# EAGLE schematic pyPhotometry_2.0 (EAGLE 6.6.0)
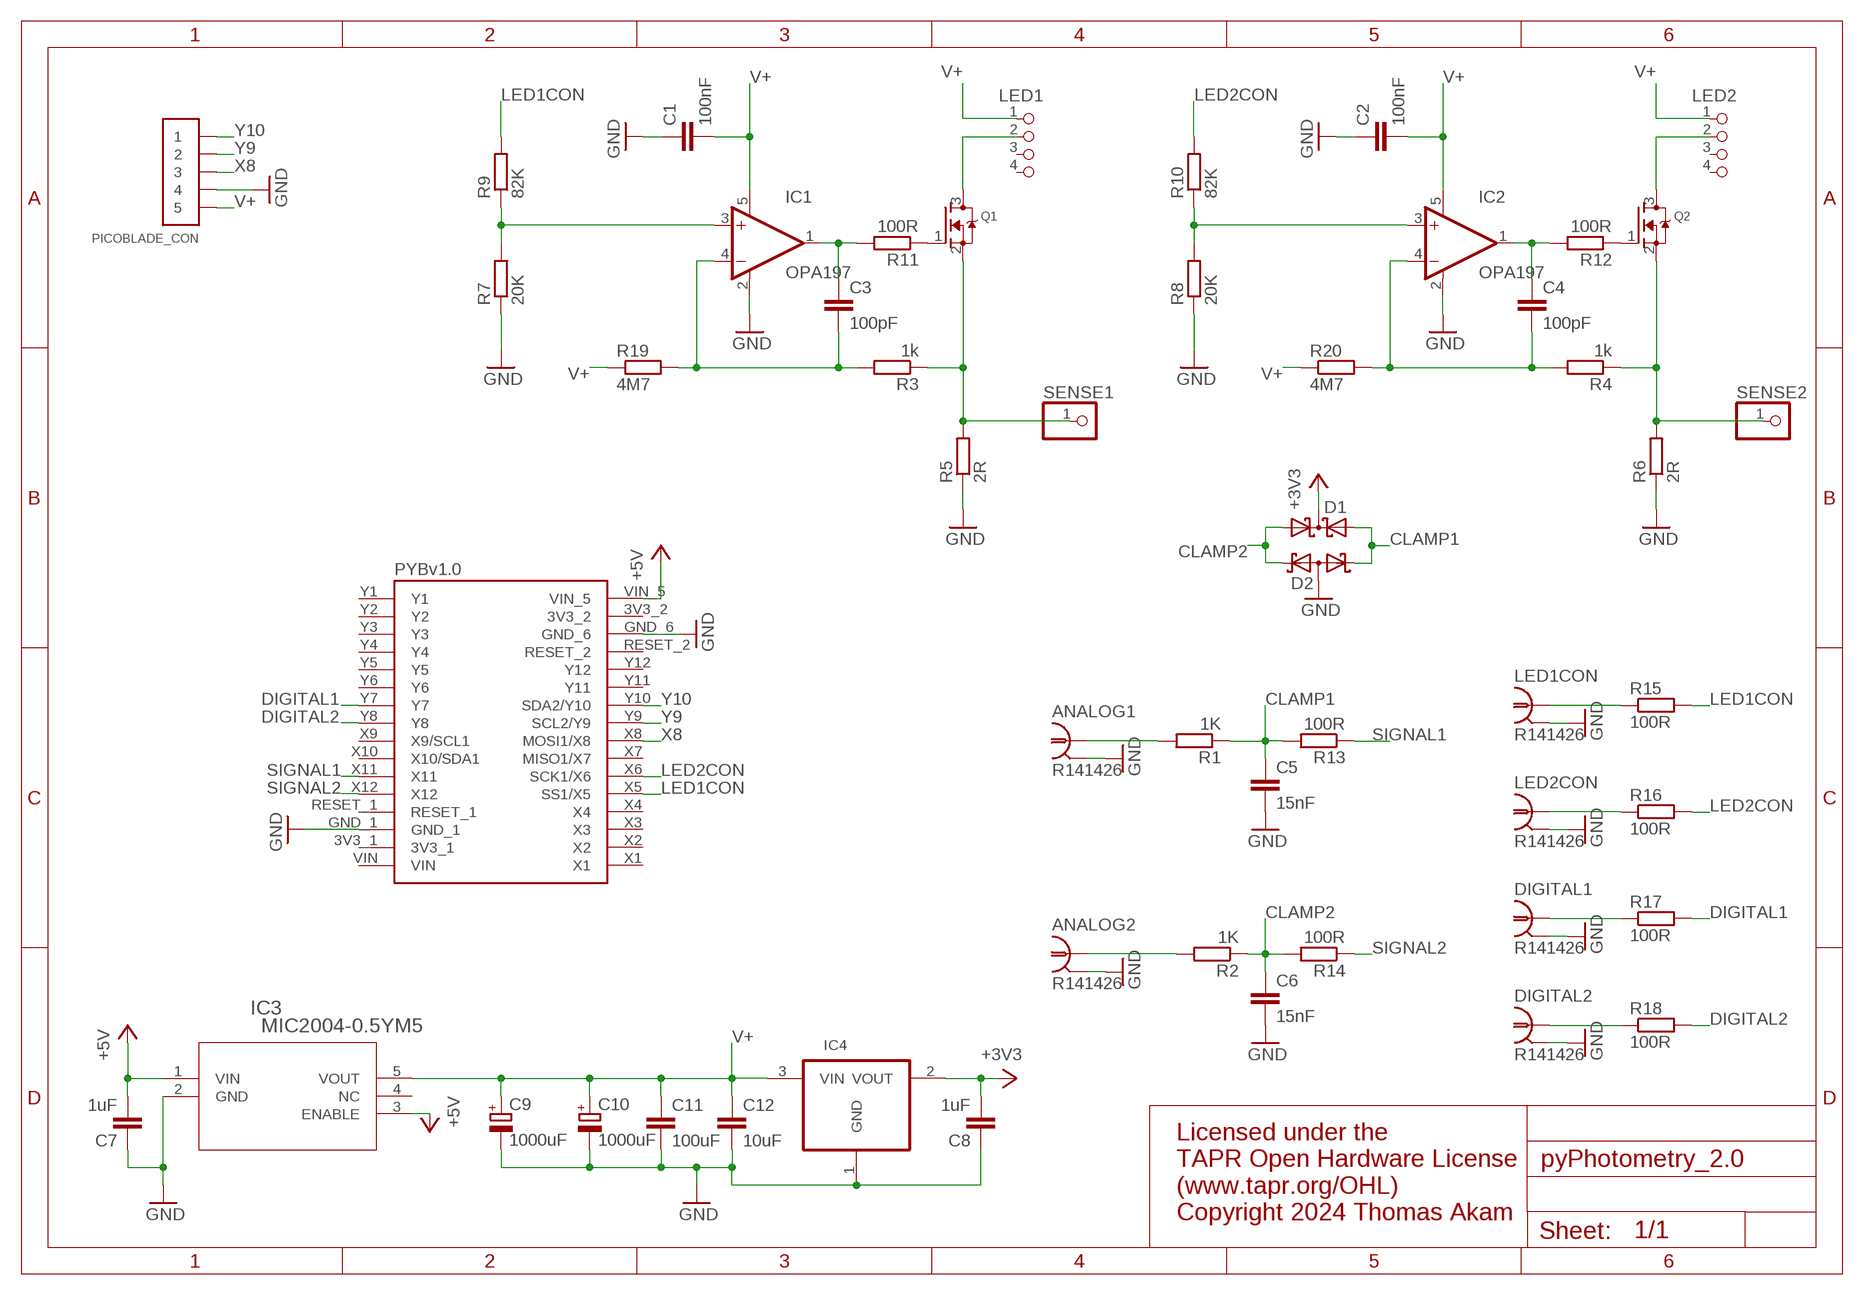
[diagram p0: schematic, sheet 1]

## Parts
ANALOG1  R141426  [R141426]
ANALOG2  R141426  [R141426]
C1  100nF  C-EUC0603K  [C0603K]
C2  100nF  C-EUC0603  [C0603]
C3  100pF  C-EUC0603K  [C0603K]
C4  100pF  C-EUC0603K  [C0603K]
C5  15nF  C-EUC0603K  [C0603K]
C6  15nF  C-EUC0603K  [C0603K]
C7  1uF  C-EUC0603  [C0603]
C8  1uF  C-EUC0603  [C0603]
C9  1000uF  CPOL-EU153CLV-0807  [153CLV-0807]
C10  1000uF  CPOL-EU153CLV-0807  [153CLV-0807]
C11  100uF  C-EUC1206  [C1206]
C12  10uF  C-EUC1206  [C1206]
D1  BAT54C  [SOT23]
D2  BAT54A  [SOT23]
DIGITAL1  R141426  [R141426]
DIGITAL2  R141426  [R141426]
IC1  OPA197  [SOT23-5]
IC2  OPA197  [SOT23-5]
IC3  MIC2004-0.5YM5  [SOT-23-5_M5]
IC4  MCP1700T-3302E/TT  [SOT95P237X112-3N]
LED1  M8-4  [M8-4]
LED1CON  R141426  [R141426]
LED2  M8-4  [M8-4]
LED2CON  R141426  [R141426]
PICOBLADE_CON  CONN_5-1-53261  [PB-53261-05]
Q1  MOSFET-NREFLOW  [SOT23]
Q2  MOSFET-NREFLOW  [SOT23]
R1  1K  R-EU_R0603  [R0603]
R2  1K  R-EU_R0603  [R0603]
R3  1k  R-EU_R0603  [R0603]
R4  1k  R-EU_R0603  [R0603]
R5  2R  R-EU_R0603  [R0603]
R6  2R  R-EU_R0603  [R0603]
R7  20K  R-EU_R0603  [R0603]
R8  20K  R-EU_R0603  [R0603]
R9  82K  R-EU_R0603  [R0603]
R10  82K  R-EU_R0603  [R0603]
R11  100R  R-EU_R0603  [R0603]
R12  100R  R-EU_R0603  [R0603]
R13  100R  R-EU_R0603  [R0603]
R14  100R  R-EU_R0603  [R0603]
R15  100R  R-EU_R0603  [R0603]
R16  100R  R-EU_R0603  [R0603]
R17  100R  R-EU_R0603  [R0603]
R18  100R  R-EU_R0603  [R0603]
R19  4M7  R-EU_R0603  [R0603]
R20  4M7  R-EU_R0603  [R0603]
SENSE1  PINHD-1X1  [1X01]
SENSE2  PINHD-1X1  [1X01]
U$1  PYBOARD-REDUCED-3  [PYBOARD-REDUCED-3]

## Nets
+3V3: C8.2 D1.3(CC) IC4.2(VOUT)
+5V: C7.2 IC3.1(VIN) IC3.3(ENABLE) U$1.VIN_5
A1: ANALOG1.1 R1.2
A2: ANALOG2.1 R2.2
CLAMP1: C5.1 D1.2(A2) D2.1(K1) R1.1 R13.2
CLAMP2: C6.1 D1.1(A1) D2.2(K2) R2.1 R14.2
DIGITAL1: R17.2 U$1.Y7
DIGITAL2: R18.2 U$1.Y8
GND: ANALOG1.2(GND) ANALOG2.2(GND) C1.1 C2.1 C5.2 C6.2 C7.1 C8.1 C9.- C10.- C11.2 C12.2 D2.3(AA) DIGITAL1.2(GND) DIGITAL2.2(GND) IC1.2(V-) IC2.2(V-) IC3.2(GND) IC4.1(GND) LED1CON.2(GND) LED2CON.2(GND) PICOBLADE_CON.4 R5.1 R6.1 R7.1 R8.1 U$1.GND_1 U$1.GND_6
LED1CON: R9.2 R15.2 U$1.X5(SS1/X5)
LED2CON: R10.2 R16.2 U$1.X6(SCK1/X6)
N$1: C3.1 IC1.1(OUT) R11.2
N$2: C3.2 IC1.4(-IN) R3.2 R19.2
N$3: IC1.3(+IN) R7.2 R9.1
N$7: Q1.1(G) R11.1
N$8: LED1.2 Q1.3(D)
N$9: Q1.2(S) R3.1 R5.2 SENSE1.1
N$11: C4.1 IC2.1(OUT) R12.2
N$12: Q2.2(S) R4.1 R6.2 SENSE2.1
N$13: C4.2 IC2.4(-IN) R4.2 R20.2
N$14: IC2.3(+IN) R8.2 R10.1
N$15: Q2.1(G) R12.1
N$16: LED2.2 Q2.3(D)
N$17: DIGITAL1.1 R17.1
N$18: LED1CON.1 R15.1
N$19: DIGITAL2.1 R18.1
N$24: LED2CON.1 R16.1
SIGNAL1: R13.1 U$1.X11
SIGNAL2: R14.1 U$1.X12
V+: C1.2 C2.2 C9.+ C10.+ C11.1 C12.1 IC1.5(V+) IC2.5(V+) IC3.5(VOUT) IC4.3(VIN) LED1.1 LED2.1 PICOBLADE_CON.5 R19.1 R20.1
X8: PICOBLADE_CON.3 U$1.X8(MOSI1/X8)
Y9: PICOBLADE_CON.2 U$1.Y9(SCL2/Y9)
Y10: PICOBLADE_CON.1 U$1.Y10(SDA2/Y10)
Unconnected: IC3.4(NC) LED1.3 LED1.4 LED2.3 LED2.4 U$1.3V3_1 U$1.3V3_2 U$1.RESET_1 U$1.RESET_2 U$1.VIN U$1.X1 U$1.X2 U$1.X3 U$1.X4 U$1.X7(MISO1/X7) U$1.X9(X9/SCL1) U$1.X10(X10/SDA1) U$1.Y1 U$1.Y2 U$1.Y3 U$1.Y4 U$1.Y5 U$1.Y6 U$1.Y11 U$1.Y12

## Notes on the sheet
- Licensed under the 
  TAPR Open Hardware License
  (www.tapr.org/OHL)
  Copyright 2024 Thomas Akam

## Power pins joined to a net without a drawn wire
GND: ANALOG1.3(GND) ANALOG1.4(GND) ANALOG1.5(GND) ANALOG2.3(GND) ANALOG2.4(GND) ANALOG2.5(GND) DIGITAL1.3(GND) DIGITAL1.4(GND) DIGITAL1.5(GND) DIGITAL2.3(GND) DIGITAL2.4(GND) DIGITAL2.5(GND) LED1CON.3(GND) LED1CON.4(GND) LED1CON.5(GND) LED2CON.3(GND) LED2CON.4(GND) LED2CON.5(GND)

## Library data of the parts
ANALOG1 ANALOG2 DIGITAL1 DIGITAL2 LED1CON LED2CON = con-coax:R141426: BNC COAX CONNECTOR Radiall 50/75 Ohm Spoerle; MF: FARNELL; MPN: R141426161; OC_FARNELL: 4195115; OC_NEWARK: 14J7919
C1-C8 C11 C12 = rcl:C-EU: CAPACITOR, European symbol
C9 C10 = rcl:CPOL-EU: POLARIZED CAPACITOR, European symbol
D1 = diode:BAT54C: Schottky Diodes Source: Fairchild .. BAT54.pdf
D2 = diode:BAT54A: Schottky Diodes Source: Fairchild .. BAT54.pdf
IC1 IC2 = burr-brown:OPA197
IC3 = MIC2004:MIC2004-0.5YM5; MANUFACTURER_PART_NUMBER: MIC20040.5YM5; VENDOR: Micrel
IC4 = LDO_regulators:MCP1700T-3302E/TT: Low Quiescent Current LDO; MPN: MCP1700T-3302E/TT; OC_FARNELL: 1296592; OC_NEWARK: 88H9817; PACKAGE: SOT23-3; SUPPLIER: Microchip
LED1 LED2 = pinhead:M8-4
PICOBLADE_CON = pel_molex:CONN_5-1
Q1 Q2 = adafruit:MOSFET-N: N-Channel Mosfet 2N7002E - 60V 260mA SOT23 [Digikey: 2N7002ET1GOSTR-ND] - REEL BSH103 - 30V 850mA SOT23 [Digikey: 568-5013-1-ND]
R1-R20 = resistor:R-EU_: RESISTOR, European symbol
SENSE1 SENSE2 = adafruit:PINHD-1X1: Pin header 1x1 for 0.1" spacing With round pins
U$1 = micropython:PYBOARD-REDUCED-3